# Altium schematic sheet voltage_inverter.SchDoc
size A
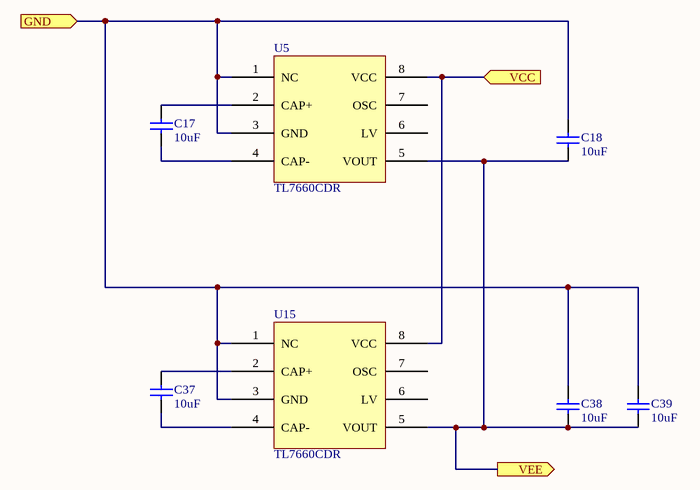
[diagram p0: voltage_inverter.SchDoc]

## Parts
C17  10uF  [C0603]
C18  10uF  [C0603]
C37  10uF  [C0603]
C38  10uF  [C0603]
C39  10uF  [C0603]
U5  TL7660CDR  [soic8]
U15  TL7660CDR  [soic8]

## Ports
GND (in), VCC (in), VEE (out)

## Nets
GND: C18.2 C38.2 C39.2 U5.1(NC) U5.3(GND) U15.1(NC) U15.3(GND) ; port GND
VCC: U5.8(VCC) U15.8(VCC) ; port VCC
VEE: C18.1 C38.1 C39.1 U5.5(VOUT) U15.5(VOUT) ; port VEE
NetC17_1: C17.1 U5.4(CAP-)
NetC17_2: C17.2 U5.2(CAP+)
NetC37_1: C37.1 U15.4(CAP-)
NetC37_2: C37.2 U15.2(CAP+)

Not connected (* = marked no-connect by the designer): U5 6(LV) 7(OSC); U15 6(LV) 7(OSC)

## Library data of the parts
C17 C18 C37-C39 = C10uF: 10 uF Surface Mount Capacitor; Manufacturer: Yageo; Manufacturer Part Number: CC0603KRX5R5BB106; Capacitance: 10µF; Tolerance: ±10%; Voltage - Rated: 6.3V; Temperature Coefficient: X5R; Supplier 1: Digi-Key; RoHS: RoHS Compliant; Category: Capacitors; Stock 1: 18386; Pricing 1: 1=0.27, 10=0.186, 25=0.1488, 50=0.124, 100=0.1054, 250=0.08368, 500=0.0744, 1000=0.06509 (USD); Packaging: Digi-Reel®; Part Status: Active; Operating Temperature: -55°C ~ 85°C; Features: -; Ratings: -; Applications: General Purpose; Mounting Type: Surface Mount, MLCC; Package / Case: 0603 (1608 Metric); Size / Dimension: 0.063" L x 0.031" W (1.60mm x 0.80mm); Height - Seated (Max): -; Thickness (Max): 0.035" (0.90mm); Lead Spacing: -; Lead Style: -; ComponentLink1URL: http://www.yageo.com/documents/recent/UPY-GPHC_X5R_4V-to-50V_23.pdf; ComponentLink1Description: http://www.yageo.com/documents/recent/UPY-GPHC_X5R_4V-to-50V_23.pdf; Failure Rate: -; Supplier Part Number 1: 311-1781-6-ND
U5 U15 = TL7660CDR: IC Switched Cap Voltage Inverter; Manufacturer: Texas Instruments; Function: Ratiometric; Output Configuration: Positive or Negative; Topology: Charge Pump; Output Type: Fixed; Number of Outputs: 1; Voltage - Input (Min): 1.5V; Voltage - Input (Max): 10V; Voltage - Output (Min/Fixed): -Vin, 2Vin; Frequency - Switching: 10kHz; Synchronous Rectifier: No; Supplier 1: Digi-Key; Manufacturer Part Number: TL7660CDR; RoHS: RoHS Compliant; Category: Integrated Circuits (ICs); Stock 1: 1431; Pricing 1: 1=1.36, 10=1.216, 100=0.948, 500=0.784, 1000=0.62 (USD); Packaging: Cut Tape (CT); Part Status: Active; Voltage - Output (Max): -; Current - Output: -; Operating Temperature: -40°C ~ 85°C (TA); Mounting Type: Surface Mount; Package / Case: 8-SOIC (0.154", 3.90mm Width); Supplier Device Package: 8-SOIC; ComponentLink1URL: http://www.ti.com/lit/ds/symlink/tl7660.pdf; ComponentLink1Description: http://www.ti.com/lit/ds/symlink/tl7660.pdf; Supplier Part Number 1: 296-21856-1-ND